# Altium schematic sheet modul.SchDoc
size 180 x 160 mm
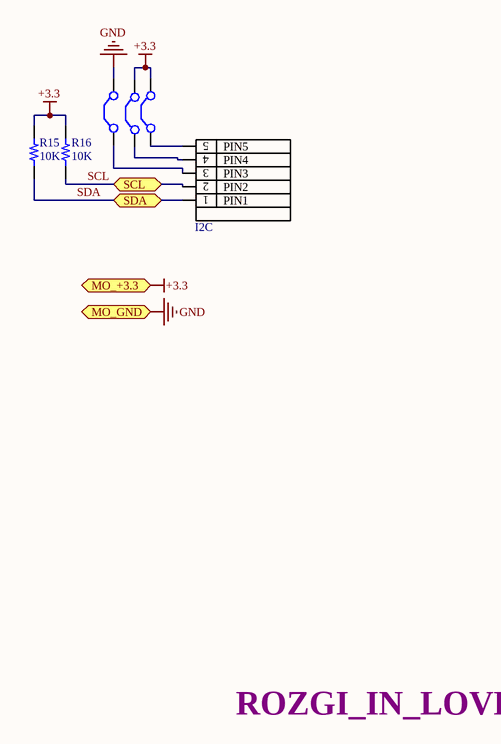
[diagram p0: modul.SchDoc]

## Parts
I2C  Ğàçú¸ì PLS-5  [JST B5B-PH-K]  (value not drawn)
JS1  Ïåğåìû÷êà SMD 1206  [Jumper SMD Small]  (value not drawn)  (net tie, no BOM)
JS2  Ïåğåìû÷êà SMD 1206  [Jumper SMD Small]  (value not drawn)  (net tie, no BOM)
JS3  Ïåğåìû÷êà SMD 1206  [Jumper SMD Small]  (value not drawn)  (net tie, no BOM)
R15  10K  [RES 0603]
R16  10K  [RES 0603]

## Ports
MO_+3.3, MO_GND, SCL, SDA

## Nets
+3.3: JS2.2 JS3.2 R15.2 R16.2 ; port MO_+3.3
GND: JS1.2 ; port MO_GND
SCL: I2C.1(PIN2) R16.1 ; port SCL
SDA: I2C.2(PIN1) R15.1 ; port SDA
NetI2C_3: I2C.3(PIN3) JS1.1
NetI2C_4: I2C.4(PIN4) JS3.1
NetI2C_5: I2C.5(PIN5) JS2.1

## Notes on the sheet
- ROZGI_IN_LOVE

## Library data of the parts
I2C = HDR 1x5: Male, 5 pin single in line, 2.54; ComponentLink1Description: Ñàéò ïğîèçâîäèòåëÿ; ComponentLink2Description: Datasheet; Device: PLS-5; Family: Ğàçú¸ì; ComponentLink3Description: Ãäå êóïèòü?
JS1-JS3 = Jumper: Ïåğåìû÷êà; Device: SMD 1206; Family: Ïåğåìû÷êà; Name: Jumper
R15 R16 = RES: Value: 1K